# Altium schematic sheet 243-436_Interface-Capteurs.SchDoc: Interface Capteurs
size Letter; ApprovedBy: APPROUVÉ PAR; Engineer: K.Cotton; Organization: Cegep Limoilou; Address1: 1300, 8e Avenue; Address2: Québec, QC; Address3: Canada; Address4: G1J 5L5; SheetNumber: 3; SheetTotal: 4
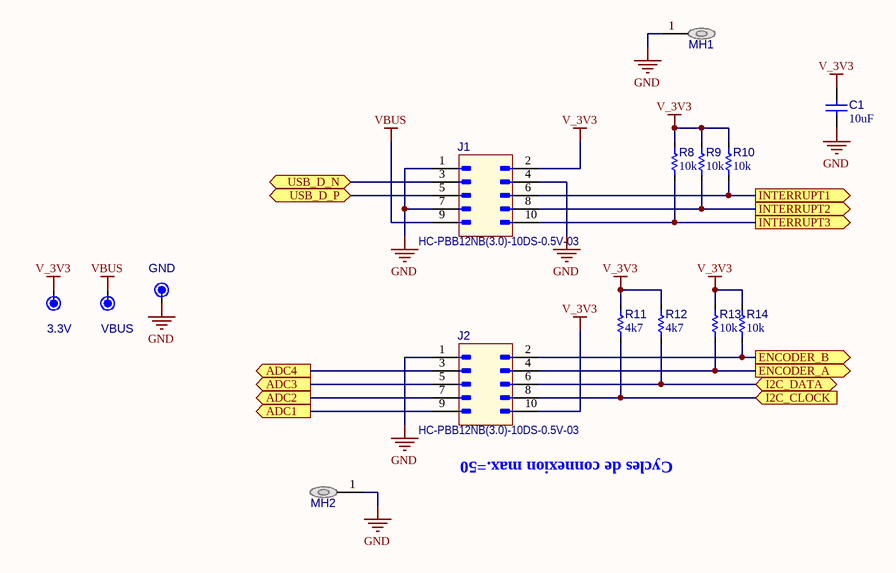
[diagram p0: 243-436_Interface-Capteurs.SchDoc]

## Parts
3.3V  DNP  [TP_TH061]  (value not drawn)  (no BOM)
C1  value 10uF  [C_2012[0805]]  (hidden comment: CAP CER 10uF 25V X5R 0805)
GND  DNP  [TP_TH061]  (value not drawn)  (no BOM)
J1  HC-PBB12NB(3.0)-10DS-0.5V-03  [J_CONN_HDR_2ROW_10POS_0MM5]
J2  HC-PBB12NB(3.0)-10DS-0.5V-03  [J_CONN_HDR_2ROW_10POS_0MM5]
MH1  MP_1.6MM  [MP_M-Hole_M1.6]  (value not drawn)  (no BOM)
MH2  MP_1.6MM  [MP_M-Hole_M1.6]  (value not drawn)  (no BOM)
R8  value 10k  [R_1005[0402]]  (hidden comment: Res 10k 1% 0402)
R9  value 10k  [R_1005[0402]]  (hidden comment: Res 10k 1% 0402)
R10  value 10k  [R_1005[0402]]  (hidden comment: Res 10k 1% 0402)
R11  value 4k7  [R_1005[0402]]  (hidden comment: Res 4k7 1% 0402)
R12  value 4k7  [R_1005[0402]]  (hidden comment: Res 4k7 1% 0402)
R13  value 10k  [R_1005[0402]]  (hidden comment: Res 10k 1% 0402)
R14  value 10k  [R_1005[0402]]  (hidden comment: Res 10k 1% 0402)
VBUS  DNP  [TP_TH061]  (value not drawn)  (no BOM)

## Ports
ADC1 (out, see 243-436_Manette-ESP32[3B]), ADC2 (out, see 243-436_Manette-ESP32[3B]), ADC3 (out, see 243-436_Manette-ESP32[3B]), ADC4 (out, see 243-436_Manette-ESP32[3B]), ENCODER_A (out, see 243-436_Manette-ESP32[3B]), ENCODER_B (out, see 243-436_Manette-ESP32[3B]), I2C_CLOCK (in, see 243-436_Manette-ESP32[3B]), I2C_DATA (bidir, see 243-436_Manette-ESP32[3A]), INTERRUPT1 (out, see 243-436_Manette-ESP32[3B]), INTERRUPT2 (out, see 243-436_Manette-ESP32[3B]), INTERRUPT3 (out, see 243-436_Manette-ESP32[3B]), USB_D_N (bidir, see 243-436_Manette-ESP32[4B]), USB_D_P (bidir, see 243-436_Manette-ESP32[4B])

## Nets
GND: C1.1 GND.1 J1.1 J1.4 J1.7 J2.1 MH1.1 MH2.1
V_3V3: 3.3V.1 C1.2 J1.2 J2.10 R8.2 R9.2 R10.2 R11.2 R12.2 R13.2 R14.2
VBUS: J1.9 VBUS.1
ADC1: J2.9 ; port ADC1
ADC2: J2.7 ; port ADC2
ADC3: J2.5 ; port ADC3
ADC4: J2.3 ; port ADC4
ENCODER_A: J2.4 R13.1 ; port ENCODER_A
ENCODER_B: J2.2 R14.1 ; port ENCODER_B
I2C_CLOCK: J2.8 R11.1 ; port I2C_CLOCK
I2C_DATA: J2.6 R12.1 ; port I2C_DATA
INTERRUPT1: J1.6 R10.1 ; port INTERRUPT1
INTERRUPT2: J1.8 R9.1 ; port INTERRUPT2
INTERRUPT3: J1.10 R8.1 ; port INTERRUPT3
USB_D_N: J1.3 ; port USB_D_N
USB_D_P: J1.5 ; port USB_D_P

## Notes on the sheet
- (near J2) Cycles de connexion max.=50
- Titre :
- Conception :
- Date :
- Approbation :
- Heure :
- Révision :
- Feuille
- de
- Fichier :

## Library data of the parts
3.3V GND VBUS = TP_TH0.61mm(AWG28): Pad TH 0.61mm diameter (AWG28); Value: DNP; Manufacturer Part Number 1: DNP; Supplier Part Number 1: N/A; Supplier 1: N/A
C1 = CAP020: Capacitor type 1; Manufacturer 1: Samsung; Manufacturer Part Number 1: CL21A106KAYNNNE; LibRef: CAP020; Tolerance: 10%; Rated Voltage: 25V; Dielectric: X5R; Mounting Technology: SMT; Supplier 1: LCSC; Supplier Part Number 1: C15850
J1 J2 = J_Conn_02x05: Connector Receptacle 2x5pos, 0,5mm; Manufacturer 1: Hirose; Manufacturer Part Number 1: DF12NB(3.0)-10DS-0.5V(51); Code CEGEP: KPTSO011; Manufacturer 2: HCTL; Manufacturer Part Number 2: HC-PBB12NB(3.0)-10DS-0.5V-03; Mounting Technology: SMT; Value: Conn_02x05; Supplier 1: LCSC; Supplier 2: Digikey; Supplier Part Number 1: C2904118; Supplier Part Number 2: 26-DF12NB(3.0)-10DS-0.5V(51)CT-ND
MH1 MH2 = MP_1.6MM: Mounting Hole 1.6mm; Mounting Technology: Through-hole
R8-R10 R13 R14 = RES003: Resistor type 1; Manufacturer 1: Yageo; Manufacturer Part Number 1: RC0402FR-0710KL; LibRef: RES003; Puissance: 1/16W; Max Working Voltage: 50V; Tolerance: 1%; Mounting Technology: SMT; Supplier 1: LCSC; Supplier Part Number 1: C60490
R11 R12 = RES007: Resistor type 1; Manufacturer 1: Yageo; Manufacturer Part Number 1: RC0402FR-074K7L; LibRef: RES007; Puissance: 1/16W; Max Working Voltage: 50V; Code CEGEP: RES4.7KSM; Tolerance: 1%; Mounting Technology: SMT; Supplier 1: LCSC; Supplier Part Number 1: C105871